# Altium schematic sheet bluetooth.SchDoc
size Letter
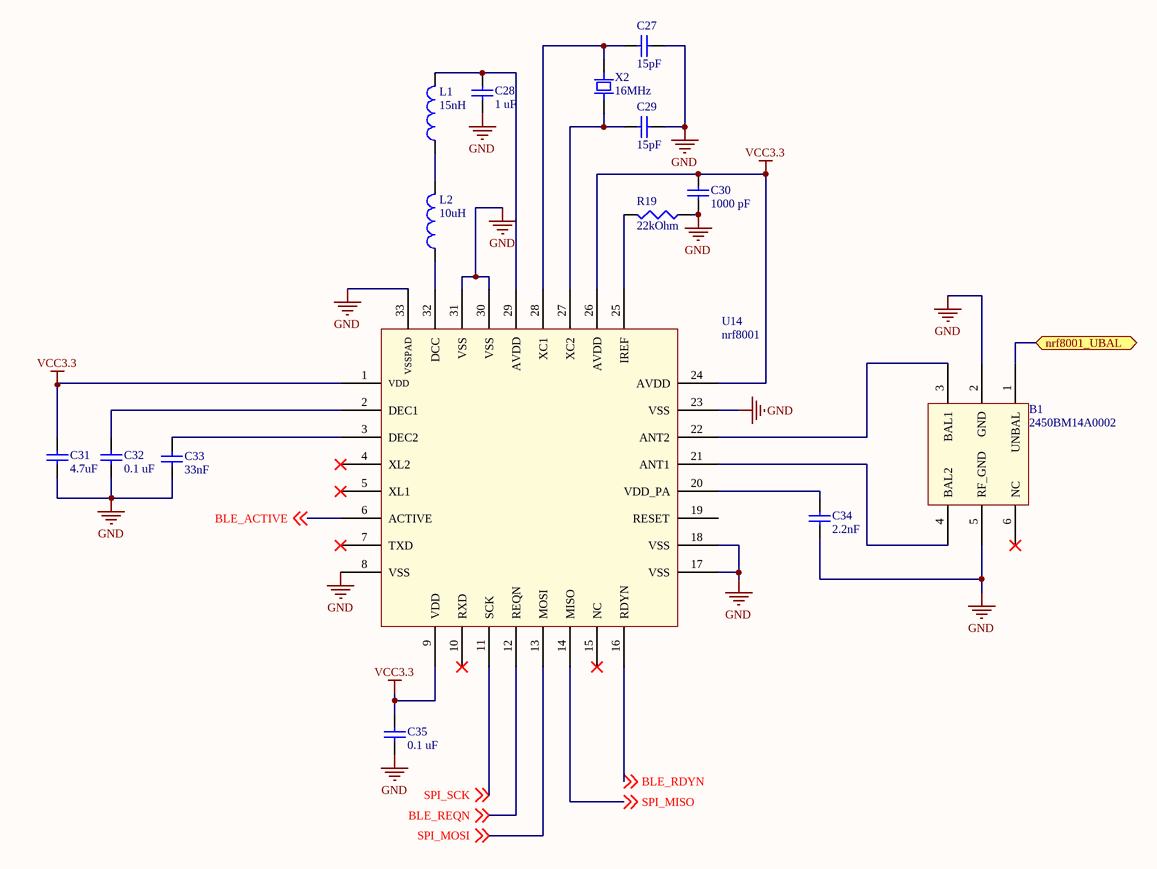
[diagram p0: bluetooth.SchDoc]

## Parts
B1  2450BM14A0002  [2450BM14A0002]
C27  value 15pF  [0402]  (hidden comment: 15pF 0402 ceramic cap)
C28  value 1 uF  [0402]  (hidden comment: Ceramic capacitor)
C29  value 15pF  [0402]  (hidden comment: 15pF 0402 ceramic cap)
C30  value 1000 pF  [0402]  (hidden comment: Ceramic capacitor)
C31  4.7uF  [0402]
C32  value 0.1 uF  [0402]  (hidden comment: Ceramic capacitor)
C33  33nF  [0402]
C34  2.2nF  [0402]
C35  value 0.1 uF  [0402]  (hidden comment: Ceramic capacitor)
L1  value 15nH  [0402]  (hidden comment: 15nH chip inductor)
L2  value 10uH  [0603]  (hidden comment: 10uH chip inductor)
R19  value 22kOhm  [0402]  (hidden comment: 22k 0402 resistor)
U14  nrf8001  [QFN50P500X500X90_HS-33N]
X2  value 16MHz  [TSX-3225]  (hidden comment: 16MHz Crystal)

## Ports
nrf8001_UBAL

## Nets
GND: B1.2(GND) B1.5(RF_GND) C27.2 C28.2 C29.1 C30.2 C31.2 C32.2 C33.2 C34.2 C35.2 R19.2 U14.8(VSS) U14.17(VSS) U14.18(VSS) U14.23(VSS) U14.30(VSS) U14.31(VSS) U14.33(VSSPAD) X2.2 X2.4
VCC3.3: C30.1 C31.1 C35.1 U14.1(VDD) U14.9(VDD) U14.24(AVDD) U14.26(AVDD)
BLE_ACTIVE: U14.6(ACTIVE) ; off-sheet BLE_ACTIVE
BLE_RDYN: U14.16(RDYN) ; off-sheet BLE_RDYN
BLE_REQN: U14.12(REQN) ; off-sheet BLE_REQN
nrf8001_UBAL: B1.1(UNBAL) ; port nrf8001_UBAL
SPI_MISO: U14.14(MISO) ; off-sheet SPI_MISO
SPI_MOSI: U14.13(MOSI) ; off-sheet SPI_MOSI
SPI_SCK: U14.11(SCK) ; off-sheet SPI_SCK
NetB1_3: B1.3(BAL1) U14.22(ANT2)
NetB1_4: B1.4(BAL2) U14.21(ANT1)
NetC27_1: C27.1 U14.28(XC1) X2.1
NetC28_1: C28.1 L1.1 U14.29(AVDD)
NetC29_2: C29.2 U14.27(XC2) X2.3
NetC32_1: C32.1 U14.2(DEC1)
NetC33_1: C33.1 U14.3(DEC2)
NetC34_1: C34.1 U14.20(VDD_PA)
NetL1_2: L1.2 L2.1
NetL2_2: L2.2 U14.32(DCC)
NetR19_1: R19.1 U14.25(IREF)

Not connected (* = marked no-connect by the designer): B1 6(NC)*; U14 4(XL2)* 5(XL1)* 7(TXD)* 10(RXD)* 15(NC)* 19(RESET)

## Notes on the sheet
- Title
- Date:
- Author:
- Revision:
- Sheet
- of
- University of Michigan
- File:

## Library data of the parts
B1 = nrf8001_balun: nrf8001 chip balun; Mfr: Johanson; Mfr Part Number: 2450BM14A0002; Supplier 1: Digikey; Supplier Part Number 1: 712-1574-1-ND
C27 C29 = C_15p_0402_ceramic: 15pF, 2%, NP0, 0402; Mfr: Murata; Mfr Part Number: GRM1555C1H150GA01D; Supplier 1: Digikey; Supplier Part Number 1: 490-6201-1-ND
C28 = C_1u_0402_ceramic: Ceramic capacitor, 1 uF, 0402 package; Manufacture: TDK; voltage rated: 6.3 V; tolerance: 10%; package: 0402; Supplier 1: Digi-Key; Supplier Part Number 1: 445-5000-1-ND
C30 = C_1000p_0402_ceramic: Ceramic capacitor, 1000 pF, 0402 package; Manufacture: TDK; voltage rated: 50 V; tolerance: 10%; package: 0402; Supplier 1: Digi-Key; Supplier Part Number 1: 445-6846-1-ND
C31 = C_4.7u_0402_ceramic: 4.7 uF 10% 0402 6.3V X5R ceramic cap; Manufacturer: TDK; Supplier 1: Digikey; Supplier Part Number 1: 445-5947-1-ND
C32 C35 = C_0.1u_0402_ceramic: Ceramic capacitor, 0.1u, 0402 package; Manufacture: TDK; voltage rated: 10 V; tolerance: 10%; Supplier 1: Digi-Key; Supplier Part Number 1: 445-1265-1-ND; package: 0402
C33 = C_0.033uF_0402_ceramic: 33nF 10% 0402 16V X7R ceramic cap; Manufacturer: Samsung; Supplier 1: Digikey; Supplier Part Number 1: 1276-1177-1-ND
C34 = C_2.2n_0402_ceramic: 2.2nF 10% 50V X7R ceramic cap; Manufacturer: TDK; Supplier 1: Digikey; Supplier Part Number 1: 445-1257-1-ND
L1 = L_15nH_0402: 15 nH, 5%, 460mOhm, 2.3Ghz, 0402 chip inductor; Mfr: Taiyo Yuden; Mfr Part Number: HK100515NJ-T; Supplier 1: Digikey; Supplier Part Number 1: 587-1521-1-ND
L2 = L_10u_0603: 10uH, 10%, 32MHz, 468 mOhm, 0603, chip inductor; Mfr: Taiyo Yuden; Mfr Part Number: LBMF1608T100K; Supplier 1: Digikey; Supplier Part Number 1: LBMF1608T100K
R19 = R_22k_0402: 22k 1% .063W 0402 resistor; Mfr: Samsung; Mfr Part Number: RC1005F223CS; Supplier 1: Digikey; Supplier Part Number 1: 1276-4143-1-ND
U14 = nrf8001: nrf8001 Bluetooth SPI module; Supplier 1: Digikey; Supplier Part Number 1: 1490-1026-ND
X2 = TSX-3225: 3.2x2.5mm 16MHz SMD crystal; Mfr: Epson; Mfr part Number: TSX-3225 16.0000MF09Z-AC3; Supplier 1: Digikey; Supplier Part Number 1: SER3628CT-ND